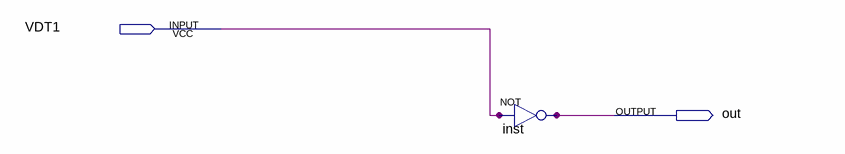
[diagram p0: schematic sheet]
// Quartus schematic asignmetn5.bdf as structural Verilog: 1 symbols, 2 pins
module asignmetn5 (
  input  VDT1,
  output out
);

  not inst (out, VDT1);
endmodule
